# EAGLE design BQ27545 (EAGLE 9.3.0)
CNAME: BQ27545 Fuel Gauge Board; CREVISION: 1a; DESIGNER: ugurkrcl
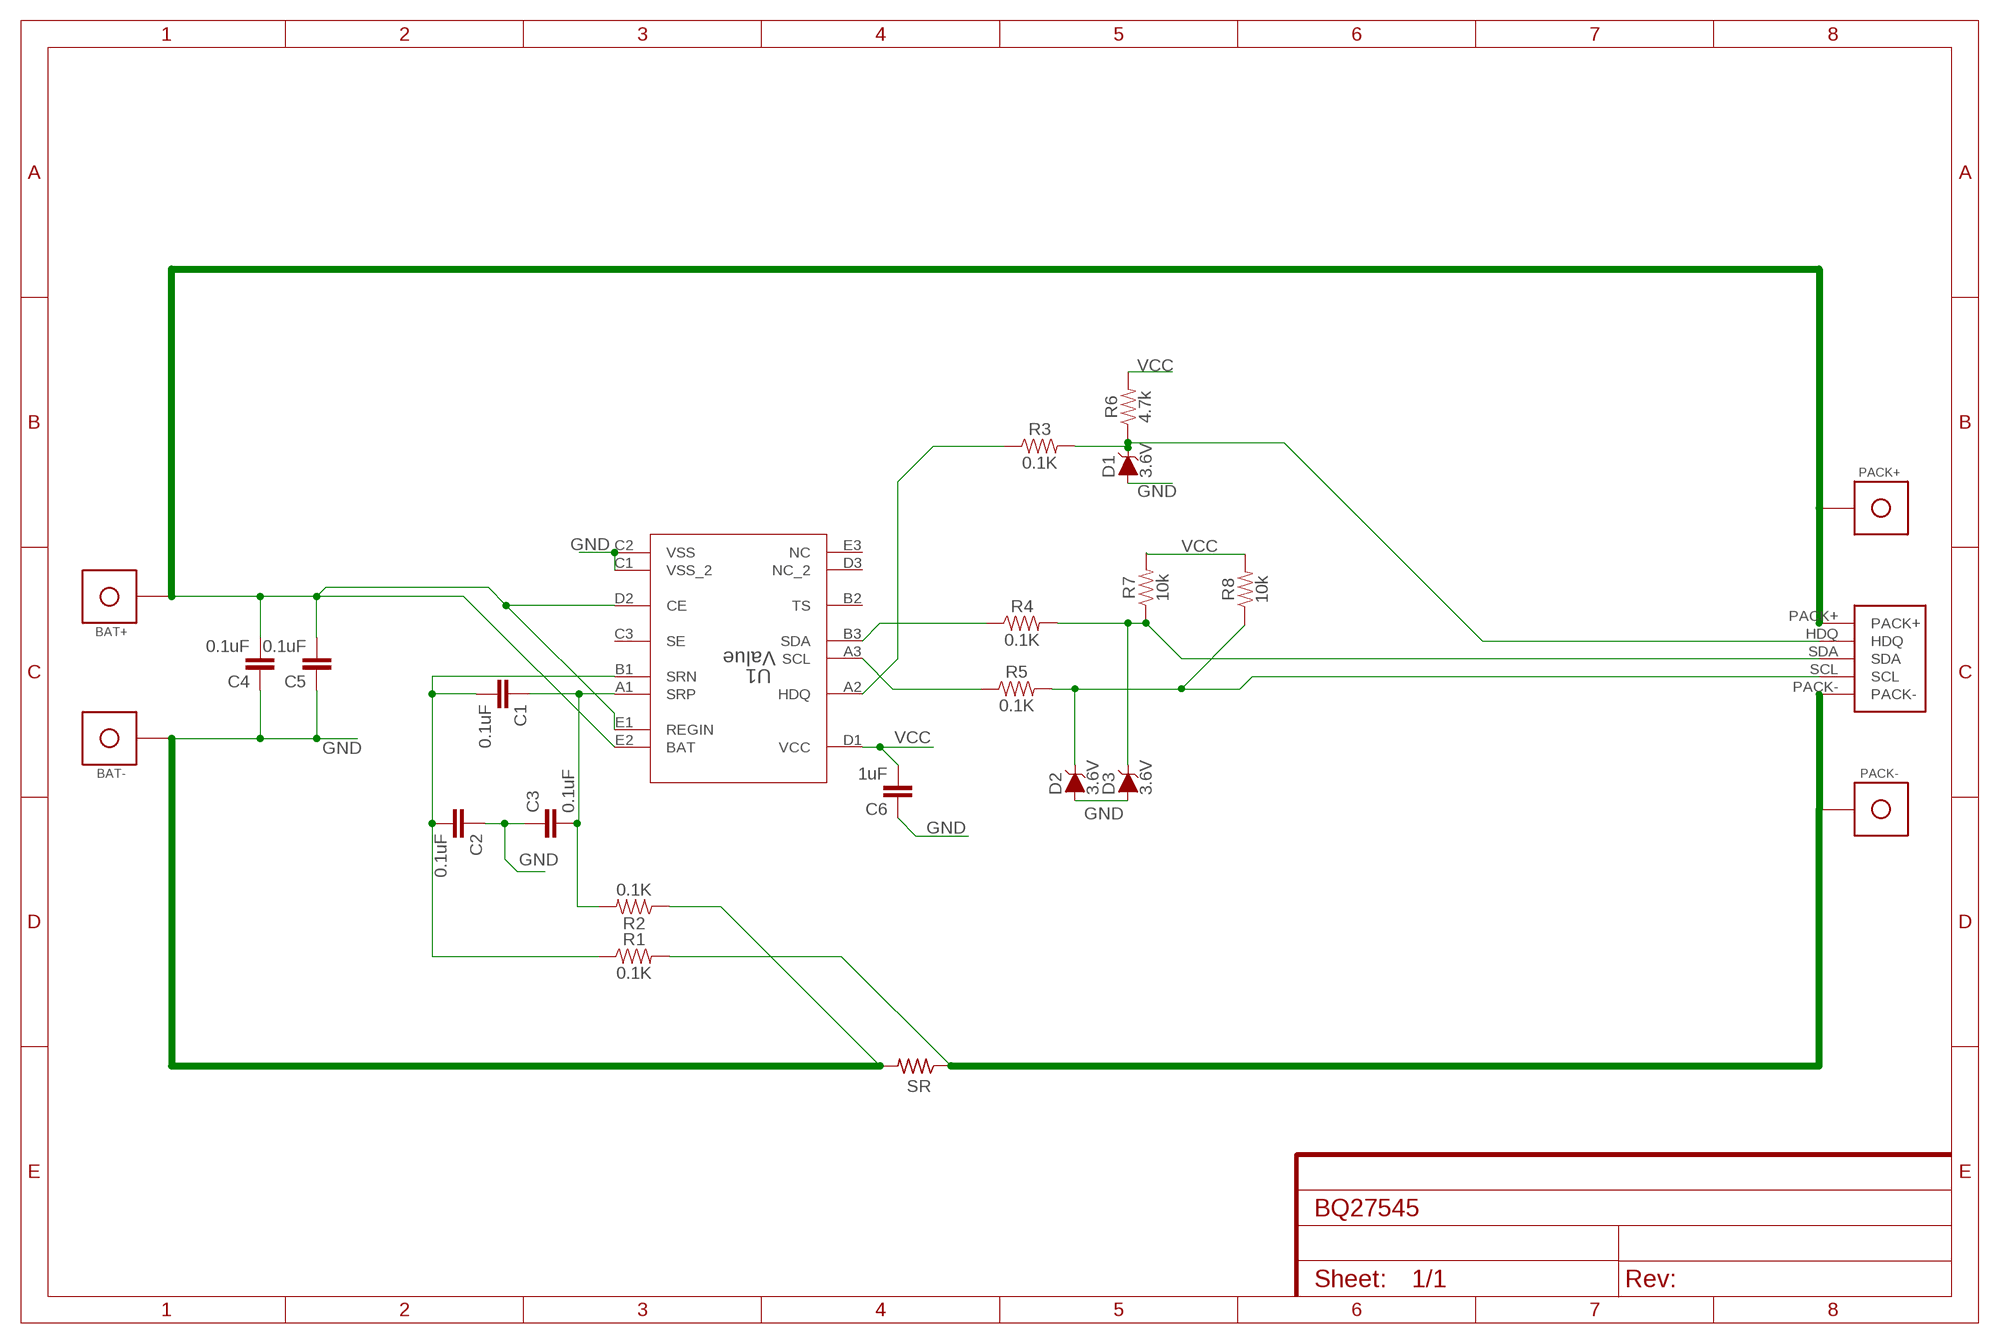
[diagram p0: schematic, sheet 1]

## Parts
BAT+  BAT_TAB  [BATT_TAB]
BAT-  BAT_TAB  [BATT_TAB]
C1  0.1uF  0.1UF-0402-16V-10%  [0402]
C2  0.1uF  0.1UF-0402-16V-10%  [0402]
C3  0.1uF  0.1UF-0402-16V-10%  [0402]
C4  0.1uF  0.1UF-0402-16V-10%  [0402]
C5  0.1uF  0.1UF-0402-16V-10%  [0402]
C6  1uF  0.1UF-0402-16V-10%  [0402]
D1  3.6V  DIODE-ZENER-BZT52C3V6S  [SOD-323]
D2  3.6V  DIODE-ZENER-BZT52C3V6S  [SOD-323]
D3  3.6V  DIODE-ZENER-BZT52C3V6S  [SOD-323]
PACK+  BAT_TAB  [BATT_TAB]
PACK-  BAT_TAB  [BATT_TAB]
R1  0.1K  RESISTOR0402  [0402]
R2  0.1K  RESISTOR0402  [0402]
R3  0.1K  RESISTOR0402  [0402]
R4  0.1K  RESISTOR0402  [0402]
R5  0.1K  RESISTOR0402  [0402]
R6  4.7k  RESISTOR0402  [0402]
R7  10k  RESISTOR0402  [0402]
R8  10k  RESISTOR0402  [0402]
SR  R-US_R2512  [R2512]
U1  Value  BQ27545_YZFR-G1  [YZF0015BBBP]
U$1  BAT_COMM_PWR_REV  [BATT_COMM_PWR_REV]

## Nets
GND: BAT-.P$1 C2.1 C3.1 C4.1 C5.1 C6.1 D1.A D2.A D3.A R2.1 SR.2 U1.C1(VSS_2) U1.C2(VSS)
N$1: R3.1 U1.A2(HDQ)
N$2: PACK-.P$1 R1.2 SR.1 U$1.PACK-
N$3: C1.1 C3.2 R2.2 U1.A1(SRP)
N$4: C1.2 C2.2 R1.1 U1.B1(SRN)
N$5: D1.C R3.2 R6.1 U$1.HDQ
N$6: R4.1 U1.B3(SDA)
N$7: R5.1 U1.A3(SCL)
N$9: D3.C R4.2 R7.1 U$1.SDA
N$10: D2.C R5.2 R8.1 U$1.SCL
PACK+: BAT+.P$1 C4.2 C5.2 PACK+.P$1 U1.D2(CE) U1.E1(REGIN) U1.E2(BAT) U$1.PACK+
VCC: C6.2 R6.2 R7.2 R8.2 U1.D1(VCC)
Unconnected: U1.B2(TS) U1.C3(SE) U1.D3(NC_2) U1.E3(NC)

## Library data of the parts
BAT+ BAT- PACK+ PACK- = ugurkrcl:BAT_TAB
C1-C5 = SparkFun-Capacitors:0.1UF: 0.1µF ceramic capacitors A capacitor is a passive two-terminal electrical component used to store electrical energy temporarily in an electric field.; PROD_ID: CAP-12416
C6 = SparkFun-Capacitors:0.1UF: 0.1µF ceramic capacitors A capacitor is a passive two-terminal electrical component used to store electrical energy temporarily in an electric field.; PROD_ID: CAP-12416; VALUE: 0.1uF
D1-D3 = SparkFun-DiscreteSemi:DIODE-ZENER: Zener Diode A Zener diode allows current to flow from its anode to its cathode like a normal semiconductor diode, but it also permits current to flow in the reverse direction when its "Zener voltage" is reached. - WIkipedia; PROD_ID: DIO-08199
R1-R8 = SparkFun-Resistors:RESISTOR: Generic Resistor Package
SR = resistor:R-US_: RESISTOR, American symbol
U1 = Fuel Gauge:BQ27545_YZFR-G1; ALTERNATEPARTNUMBER: BQ27546YZFTG1; APPLICATION_BUILDNUMBER: *; COMPTYPE: IC; MANUFACTURER: Texas Instruments; MOUNTTYPE: SMT; PACKAGEREFERENCE: YZF0015BBBP; PARTNUMBER: BQ27546YZFRG1; PIN_COUNT: 15; REFDES: RefDes; ROHS: Y; TYPE: TYPE
U$1 = ugurkrcl:BAT_COMM_PWR_REV

## Board
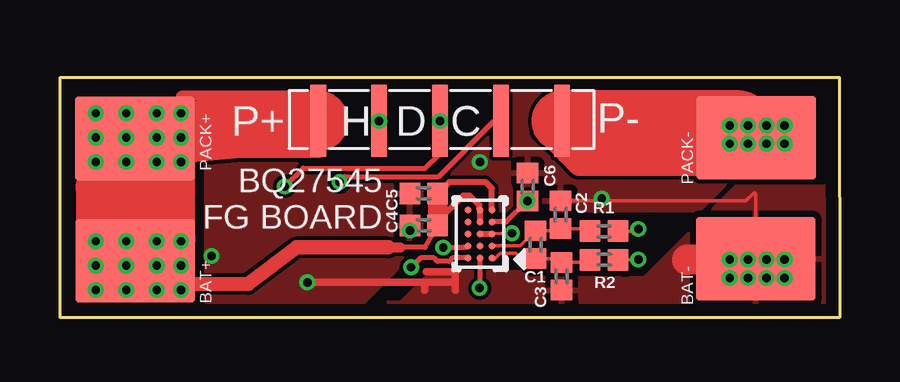
[diagram p1: board, top side]
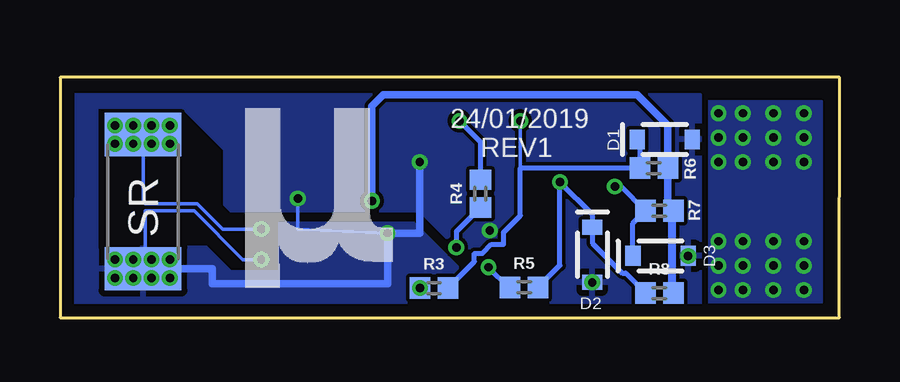
[diagram p2: board, bottom side, seen from below]

Size 32.48 x 10.01 mm. Coordinates in mm from the lower left corner, seen from the top.
Outline: 0,10.01 32.48,10.01 32.48,0 0.01,0 0,10.01
Copper layers (1*16): Top 0.035mm / dielectric 1.6mm / Bottom 0.035mm
Design rules "Elecrow_2-layer_PCB_eagle_rule *": minimum track width 6mil, minimum drill 12mil, track to track 6mil, track to pad 8mil, pad to pad 12mil, via to via 12mil, smd to smd 0mil, copper to edge 20mil, drill to drill 10mil, minimum pad ring 6mil, minimum via ring 6mil, stop-mask expansion 0mil, vias tented up to drill 100mil, thermal gap 10mil

### Footprints (pad centres in the part's own frame; a part is rotated, then mirrored left to right if it is on the bottom)
BATT_TAB = smd 5 x 3.5: P$1 0,0
0402 = smd 0.85 x 0.9: 1 -0.58,0; 2 0.58,0
SOD-323 = smd 0.63 x 0.83: A 1.15,0; C -1.15,0
R2512 = smd 1.8 x 3.2: 1 -2.8,0; 2 2.8,0
YZF0015BBBP = smd 0.3 x 0.3: A1 -0.5,1; A2 0,1; A3 0.5,1; B1 -0.5,0.5; B2 0,0.5; B3 0.5,0.5; C1 -0.5,0; C2 0,0; C3 0.5,0; D1 -0.5,-0.5; D2 0,-0.5; D3 0.5,-0.5; E1 -0.5,-1; E2 0,-1; E3 0.5,-1
BATT_COMM_PWR_REV = smd 0.65 x 3: HDQ -2.6,0; PACK+ -5.14,0; PACK- 5.02,0; SCL 2.48,0; SDA -0.06,0

### Placement (x,y rotation side)
BAT+  3.11,7.46 0 top
BAT-  28.99,2.46 0 top
C1  19.82,3.04 90 top
C2  20.86,4.29 270 top
C3  20.9,1.72 90 top
C4  15.16,3.85 0 top
C5  15.16,5.18 0 top
C6  19.48,5.45 270 top
D1  7.28,7.42 0 bottom
D2  10.31,2.62 270 bottom
D3  7.46,2.57 0 bottom
PACK+  3.13,2.37 0 top
PACK-  29.01,7.5 0 top
R1  22.67,3.61 0 top
R2  22.67,2.41 180 top
R3  16.9,1.23 0 bottom
R4  14.97,5.17 90 bottom
R5  13.15,1.26 0 bottom
R6  7.74,6.24 0 bottom
R7  7.51,4.45 0 bottom
R8  7.51,1.02 0 bottom
SR  29.02,4.84 270 bottom
U1  17.49,3.49 180 top
U$1  15.9,8.2 0 top

### Tracks (layer width: path | path; a pad name or v marks a point on that pad's centre or on a via)
GND  (via drill 0.35)
  Top 0.152: R2.1 23.26,2.42 v24.1,2.42 | U1.C1 v18.84,3.51 | D2.A 10.38,1.4 | 6.32,2.67 D3.A | BAT-.P$1 28.99,5.15 28.92,5.21 28.58,4.87 C2.1
  Top 0.254: U1.C2 U1.C1
  Top 0.305: D2.A 14,1.47 15.21,1.47 | 15.21,1.47 15.21,1.15 | 15.21,1.47 16.48,1.47 | 16.48,1.47 16.48,1.15 | 16.48,1.47 16.48,1.91 15.26,1.91 | C4.1 v14.58,3.63
  Top 1.27: BAT-.P$1 26.13,2.42
  Bottom 0.152: v24.1,2.42 24.86,2.42 26.89,4.45 28.92,4.45 28.92,1.91 v28.67,1.66 | 18.9,3.52 v18.84,3.51 22.57,3.69 v22.57,4.96
  Bottom 0.305: SR.2 26.13,2.04 26.13,1.4 18.84,1.4 v18.84,3.51 17.49,3.51 v17.49,6.48 | v14.58,3.63 14.7,3.63 14.7,3.69
  other vias: 27.91,2.42 28.67,2.42 29.43,2.42 30.19,2.42 30.19,1.66 29.43,1.66 27.91,1.66 10.31,1.47 6.31,2.57
  pour Top: 14.19,0.64 15.46,1.91 19.27,1.91 19.53,1.66 24.35,1.66 28.16,5.47 32.23,5.47 32.23,0.13 13.18,0.13 13.68,0.64
  pour Top: 32.23,5.72 32.23,9.28 32.48,9.53 6.06,9.53 6.06,0.64 12.67,0.64 15.21,3.18 15.72,3.18 16.99,4.45 26.64,4.45 27.91,5.72
  pour Bottom: 5.81,9.28 31.97,9.28 31.97,8.77 27.4,8.77 25.62,6.99 25.62,4.71 25.37,4.45 17.49,4.45 13.94,0.9 13.94,0.39 5.81,0.39
  pour Bottom: 30.96,8.77 31.97,8.77 31.97,0.39 14.45,0.39 14.45,0.64 17.75,3.94 23.34,3.94 23.34,1.91 25.37,1.91 26.38,2.93 30.96,2.93
N$1  (via drill 0.35)
  Top 0.203: U1.A2 R3.1
  other vias: 17.48,1.23
N$2  (via drill 0.35)
  Top 0.152: R1.2 24.02,3.61 v24.1,3.69 | 29.58,7.25 29.33,7.5 PACK-.P$1 29.01,7.59 v29.43,8.01
  Top 0.305: v27.91,8.01 29.01,8.01 PACK-.P$1 | PACK-.P$1 28.72,7.5 28.72,7.2 | 29.58,7.25 v30.19,7.25 | PACK-.P$1 30.19,7.5 v30.19,8.01 | PACK-.P$1 27.91,7.5 v27.91,7.25
  Top 0.635: 28.72,7.2 28.26,6.74 21.05,6.74 | 21.05,6.74 20.03,7.75 | 21.05,6.74 21.56,6.23 29.18,6.23 29.18,7.33 28.31,8.2
  Top 2.54: 28.31,8.2 U$1.PACK-
  Bottom 0.152: v24.1,3.69 25.7,3.69 26.77,4.76 28.92,4.76 29.02,4.86 SR.1 | 29.02,8.01 v29.43,8.01 | 29.02,7.25 v29.43,7.25 | SR.1 29.02,8.01 | 29.02,8.01 v28.67,8.01 | SR.1 29.02,7.25 | 29.02,7.25 v28.67,7.25
N$3
  Top 0.152: U1.A1 18.08,2.41 18.34,2.67 19.02,2.67 19.23,2.46 C1.1 | C1.1 19.76,2.41 | C1.1 20.75,2.46 C3.2 21.99,2.3 R2.2
N$4
  Top 0.152: U1.B1 19.18,2.99 C1.2 20.77,3.62 C2.2 21.98,3.71 R1.1
N$5  (via drill 0.35)
  Bottom 0.152: v13.3,8.2 13.3,6.23
  Bottom 0.203: D1.C 8.32,7.31 R6.1 13.29,6.23 13.3,6.23 13.3,4.25 14,3.56 14,3.05 14.5,3.05 14.87,2.68 15.21,2.68 15.21,2.34 R3.2
N$6  (via drill 0.35)
  Top 0.203: v15.97,2.93 16.79,2.93 16.8,2.94 16.95,2.94 U1.B3
  Bottom 0.203: R4.1 15.97,3.58 v15.97,2.93
N$7  (via drill 0.35)
  Top 0.203: v14.63,2.1 15.02,2.49 15.59,2.49 15.73,2.35 16.21,2.35 16.35,2.49 U1.A3
  Bottom 0.203: v14.63,2.1 13.79,1.26 R5.1
N$9  (via drill 0.35)
  Top 0.203: v9.37,5.47 10.13,6.23 15.21,6.23 15.84,6.86 U$1.SDA
  Bottom 0.203: D3.C 8.61,3.93 R7.1 9.1,5.47 v9.37,5.47 | U$1.SDA 14.97,7.32 R4.2
  other vias: 15.84,8.2
N$10  (via drill 0.35)
  Top 0.203: v11.65,5.65 11.88,5.87 15.77,5.87 18.09,8.2 U$1.SCL
  Bottom 0.203: R5.2 11.65,2.18 v11.65,5.65 10.31,4.3 D2.C 10.31,3.11 9.05,1.85 8.92,1.85 R8.1
PACK+  (via drill 0.35)
  Top 0.152: v1.49,7.5 v2.76,7.5 2.8,7.46 BAT+.P$1 | BAT+.P$1 2.06,8.52 v1.49,8.52 | BAT+.P$1 2.76,7.81 v2.76,8.52 | BAT+.P$1 3.4,7.75 3.78,7.75 | BAT+.P$1 3.15,7.5 v4.03,7.5 | BAT+.P$1 2.67,7.02 2.67,6.83 | BAT+.P$1 2.76,7.11 v2.76,6.48 | v4.03,3.18 3.82,2.97 3.74,2.97 PACK+.P$1 | PACK+.P$1 3.13,2.81 v2.76,3.18 | PACK+.P$1 2.32,3.18 1.24,3.18 | PACK+.P$1 3.83,2.37 v4.03,2.17 4.13,2.07 3.44,2.07 PACK+.P$1 | PACK+.P$1 2.93,2.17 v2.76,2.17 | PACK+.P$1 2.68,1.91 1.24,1.91 | PACK+.P$1 2.76,2 v2.76,1.15 | PACK+.P$1 1.92,1.15 v1.49,1.15 | PACK+.P$1 4.03,1.47 v4.03,1.15 | PACK+.P$1 4.35,1.15 4.96,1.15 v5.05,1.15 | PACK+.P$1 3.34,2.17 v5.05,2.17 | 10.76,6.95 10.76,8.52
  Top 0.203: C4.2 15.21,2.93 14.19,2.93
  Top 0.254: U1.E1 17.99,5.39 17.73,5.65 16.21,5.65 C5.2 | C4.2 15.74,4.03 16.8,5.09 17.07,5.09 17.47,4.69 17.47,4.51 U1.E2 U1.D2
  Top 0.305: 10.13,9.28 5.05,9.28 5.05,8.77 v5.05,8.52 5.05,7.46
  Top 0.406: 13.68,2.93 14.19,2.93 | U$1.PACK+ 10.76,8.52 10.76,9.24 5.05,9.24 5.05,8.77
  Top 0.61: 13.68,2.93 9.87,2.93 7.84,1.4 5.59,1.39 4.96,1.15 | v5.05,6.48 5.05,7.46 BAT+.P$1 3.11,6.95 10.76,6.95
  Top 0.813: C4.2 C5.2
  Top 1.168: 2.67,6.83 1.24,5.39 1.24,3.18 1.24,1.91 v1.49,2.17 2,2.67 2,6.48 5.05,3.44 | 5.05,3.44 v5.05,3.18 | 5.05,3.44 v5.05,6.48 v5.05,7.5 5.05,7.75 4.79,8.01 4.54,7.75 4.54,3.44 3.27,3.44 1.24,5.47 3.52,7.75 3.78,7.75
  Top 2.54: 3.78,7.75 3.13,7.11 PACK+.P$1 | U$1.PACK+ v2.76,7.5
  other vias: 4.03,8.52 4.03,6.48 1.49,6.48 1.49,3.18
  pour Bottom (no thermals): 0.73,9.02 5.46,9.02 5.46,0.64 0.73,0.64
VCC  (via drill 0.35)
  Top 0.203: C6.2 18.6,3.99 U1.D1
  Bottom 0.203: 19.48,4.96 C6.2 | 7.16,8.01 R6.2 7.16,4.68 7,4.53 R7.2 6.93,3.11 6.93,2.03 R8.2
  Bottom 0.305: R8.2 7,1.09 7,4.53 | R7.2 7.16,4.68 7.16,8.01 8.43,9.28 19.02,9.28 19.48,8.81 19.48,4.96
  other vias: 19.48,4.87

### Text on the board
tNames: PACK+ | PACK- | BQ27545 / FG BOARD | BAT+ | BAT-
bNames: 24/01/2019 / REV1